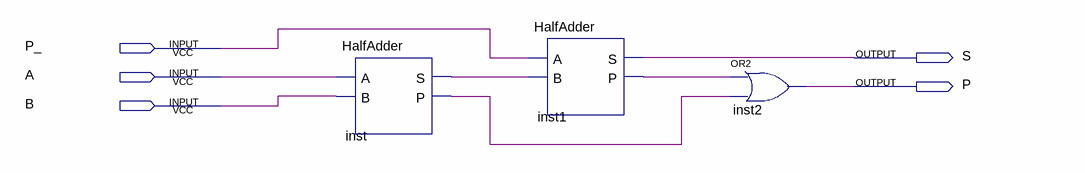
[diagram p0: schematic sheet]
// Quartus schematic FullAdder.bdf as structural Verilog: 3 symbols, 5 pins
module FullAdder (
  input  P_,
  input  A,
  input  B,
  output S,
  output P
);

  wire inst1_p, inst_p, inst_s;

  HalfAdder inst (.A(A), .B(B), .S(inst_s), .P(inst_p));
  HalfAdder inst1 (.A(P_), .B(inst_s), .S(S), .P(inst1_p));
  or inst2 (P, inst1_p, inst_p);
endmodule
